# Altium schematic sheet hierarchy.SchDoc
size A3; DocumentNumber: 1; SheetNumber: 1; SheetTotal: 14; SheetDescription: Structure of Extension
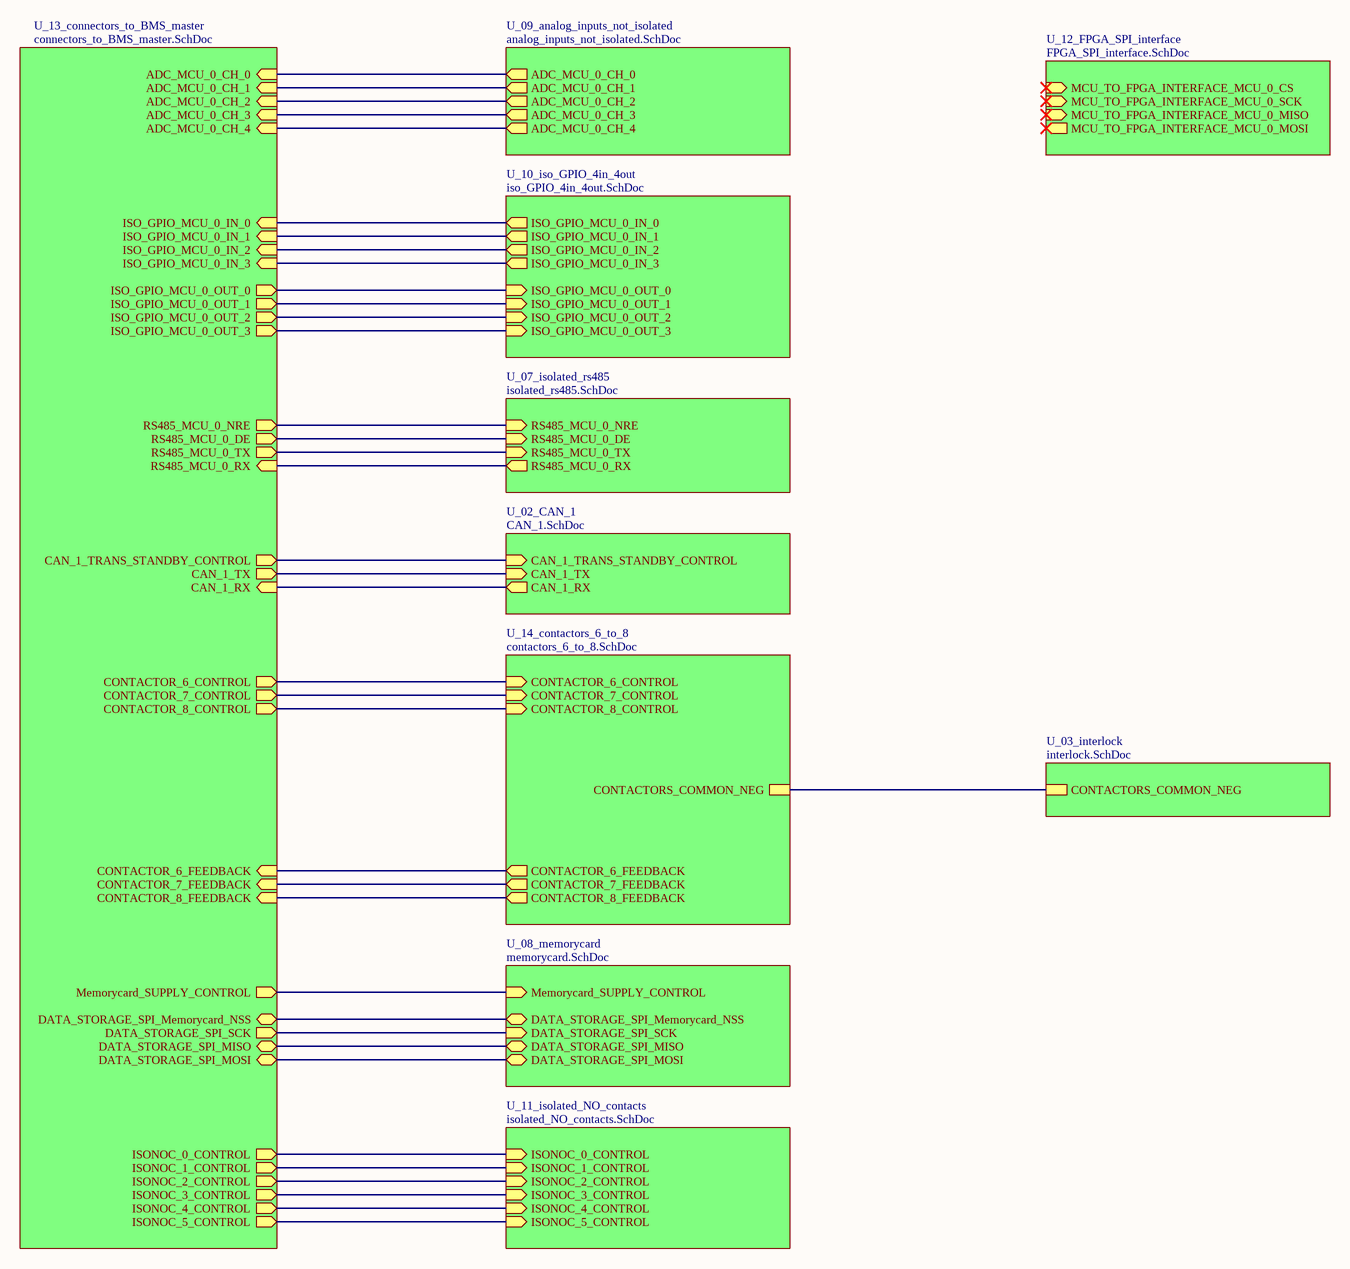
[diagram p0: hierarchy.SchDoc]

## Sub-sheets
U_02_CAN_1 = CAN_1.SchDoc: CAN_1_TX (in), CAN_1_RX (out), CAN_1_TRANS_STANDBY_CONTROL (in)
U_03_interlock = interlock.SchDoc: CONTACTORS_COMMON_NEG
U_07_isolated_rs485 = isolated_rs485.SchDoc: RS485_MCU_0_RX (out), RS485_MCU_0_NRE (in), RS485_MCU_0_DE (in), RS485_MCU_0_TX (in)
U_08_memorycard = memorycard.SchDoc: DATA_STORAGE_SPI_Memorycard_NSS (bidir), Memorycard_SUPPLY_CONTROL (in), DATA_STORAGE_SPI_SCK (in), DATA_STORAGE_SPI_MISO (bidir), DATA_STORAGE_SPI_MOSI (bidir)
U_09_analog_inputs_not_isolated = analog_inputs_not_isolated.SchDoc: ADC_MCU_0_CH_0 (out), ADC_MCU_0_CH_1 (out), ADC_MCU_0_CH_2 (out), ADC_MCU_0_CH_3 (out), ADC_MCU_0_CH_4 (out)
U_10_iso_GPIO_4in_4out = iso_GPIO_4in_4out.SchDoc: ISO_GPIO_MCU_0_OUT_1 (in), ISO_GPIO_MCU_0_IN_0 (out), ISO_GPIO_MCU_0_IN_1 (out), ISO_GPIO_MCU_0_OUT_0 (in), ISO_GPIO_MCU_0_IN_2 (out), ISO_GPIO_MCU_0_IN_3 (out), ISO_GPIO_MCU_0_OUT_2 (in), ISO_GPIO_MCU_0_OUT_3 (in)
U_11_isolated_NO_contacts = isolated_NO_contacts.SchDoc: ISONOC_0_CONTROL (in), ISONOC_1_CONTROL (in), ISONOC_2_CONTROL (in), ISONOC_3_CONTROL (in), ISONOC_4_CONTROL (in), ISONOC_5_CONTROL (in)
U_12_FPGA_SPI_interface = FPGA_SPI_interface.SchDoc: MCU_TO_FPGA_INTERFACE_MCU_0_CS (in), MCU_TO_FPGA_INTERFACE_MCU_0_MOSI (out), MCU_TO_FPGA_INTERFACE_MCU_0_MISO (in), MCU_TO_FPGA_INTERFACE_MCU_0_SCK (in)
U_13_connectors_to_BMS_master = connectors_to_BMS_master.SchDoc: CAN_1_TX (out), CAN_1_RX (in), CAN_1_TRANS_STANDBY_CONTROL (out), ISONOC_5_CONTROL (out), CONTACTOR_6_CONTROL (out), CONTACTOR_7_CONTROL (out), CONTACTOR_8_CONTROL (out), CONTACTOR_6_FEEDBACK (in), CONTACTOR_7_FEEDBACK (in), CONTACTOR_8_FEEDBACK (in), RS485_MCU_0_RX (in), RS485_MCU_0_TX (out), RS485_MCU_0_DE (out), RS485_MCU_0_NRE (out), Memorycard_SUPPLY_CONTROL (out), DATA_STORAGE_SPI_Memorycard_NSS (bidir), DATA_STORAGE_SPI_MISO (bidir), DATA_STORAGE_SPI_MOSI (bidir), DATA_STORAGE_SPI_SCK (out), ADC_MCU_0_CH_0 (in), ADC_MCU_0_CH_1 (in), ADC_MCU_0_CH_2 (in), ADC_MCU_0_CH_3 (in), ADC_MCU_0_CH_4 (in), ISO_GPIO_MCU_0_IN_0 (in), ISO_GPIO_MCU_0_IN_1 (in), ISO_GPIO_MCU_0_IN_2 (in), ISO_GPIO_MCU_0_IN_3 (in), ISO_GPIO_MCU_0_OUT_0 (out), ISO_GPIO_MCU_0_OUT_1 (out), ISO_GPIO_MCU_0_OUT_2 (out), ISO_GPIO_MCU_0_OUT_3 (out), ISONOC_0_CONTROL (out), ISONOC_1_CONTROL (out), ISONOC_2_CONTROL (out), ISONOC_3_CONTROL (out), ISONOC_4_CONTROL (out)
U_14_contactors_6_to_8 = contactors_6_to_8.SchDoc: CONTACTORS_COMMON_NEG, CONTACTOR_7_FEEDBACK (out), CONTACTOR_8_FEEDBACK (out), CONTACTOR_6_FEEDBACK (out), CONTACTOR_7_CONTROL (in), CONTACTOR_6_CONTROL (in), CONTACTOR_8_CONTROL (in)

## Nets
(unnamed): sheet U_02_CAN_1/CAN_1_TX, sheet U_13_connectors_to_BMS_master/CAN_1_TX
(unnamed): sheet U_02_CAN_1/CAN_1_RX, sheet U_13_connectors_to_BMS_master/CAN_1_RX
(unnamed): sheet U_02_CAN_1/CAN_1_TRANS_STANDBY_CONTROL, sheet U_13_connectors_to_BMS_master/CAN_1_TRANS_STANDBY_CONTROL
(unnamed): sheet U_03_interlock/CONTACTORS_COMMON_NEG, sheet U_14_contactors_6_to_8/CONTACTORS_COMMON_NEG
(unnamed): sheet U_07_isolated_rs485/RS485_MCU_0_RX, sheet U_13_connectors_to_BMS_master/RS485_MCU_0_RX
(unnamed): sheet U_07_isolated_rs485/RS485_MCU_0_NRE, sheet U_13_connectors_to_BMS_master/RS485_MCU_0_NRE
(unnamed): sheet U_07_isolated_rs485/RS485_MCU_0_DE, sheet U_13_connectors_to_BMS_master/RS485_MCU_0_DE
(unnamed): sheet U_07_isolated_rs485/RS485_MCU_0_TX, sheet U_13_connectors_to_BMS_master/RS485_MCU_0_TX
(unnamed): sheet U_08_memorycard/DATA_STORAGE_SPI_Memorycard_NSS, sheet U_13_connectors_to_BMS_master/DATA_STORAGE_SPI_Memorycard_NSS
(unnamed): sheet U_08_memorycard/Memorycard_SUPPLY_CONTROL, sheet U_13_connectors_to_BMS_master/Memorycard_SUPPLY_CONTROL
(unnamed): sheet U_08_memorycard/DATA_STORAGE_SPI_SCK, sheet U_13_connectors_to_BMS_master/DATA_STORAGE_SPI_SCK
(unnamed): sheet U_08_memorycard/DATA_STORAGE_SPI_MISO, sheet U_13_connectors_to_BMS_master/DATA_STORAGE_SPI_MISO
(unnamed): sheet U_08_memorycard/DATA_STORAGE_SPI_MOSI, sheet U_13_connectors_to_BMS_master/DATA_STORAGE_SPI_MOSI
(unnamed): sheet U_09_analog_inputs_not_isolated/ADC_MCU_0_CH_0, sheet U_13_connectors_to_BMS_master/ADC_MCU_0_CH_0
(unnamed): sheet U_09_analog_inputs_not_isolated/ADC_MCU_0_CH_1, sheet U_13_connectors_to_BMS_master/ADC_MCU_0_CH_1
(unnamed): sheet U_09_analog_inputs_not_isolated/ADC_MCU_0_CH_2, sheet U_13_connectors_to_BMS_master/ADC_MCU_0_CH_2
(unnamed): sheet U_09_analog_inputs_not_isolated/ADC_MCU_0_CH_3, sheet U_13_connectors_to_BMS_master/ADC_MCU_0_CH_3
(unnamed): sheet U_09_analog_inputs_not_isolated/ADC_MCU_0_CH_4, sheet U_13_connectors_to_BMS_master/ADC_MCU_0_CH_4
(unnamed): sheet U_10_iso_GPIO_4in_4out/ISO_GPIO_MCU_0_OUT_1, sheet U_13_connectors_to_BMS_master/ISO_GPIO_MCU_0_OUT_1
(unnamed): sheet U_10_iso_GPIO_4in_4out/ISO_GPIO_MCU_0_IN_0, sheet U_13_connectors_to_BMS_master/ISO_GPIO_MCU_0_IN_0
(unnamed): sheet U_10_iso_GPIO_4in_4out/ISO_GPIO_MCU_0_IN_1, sheet U_13_connectors_to_BMS_master/ISO_GPIO_MCU_0_IN_1
(unnamed): sheet U_10_iso_GPIO_4in_4out/ISO_GPIO_MCU_0_OUT_0, sheet U_13_connectors_to_BMS_master/ISO_GPIO_MCU_0_OUT_0
(unnamed): sheet U_10_iso_GPIO_4in_4out/ISO_GPIO_MCU_0_IN_2, sheet U_13_connectors_to_BMS_master/ISO_GPIO_MCU_0_IN_2
(unnamed): sheet U_10_iso_GPIO_4in_4out/ISO_GPIO_MCU_0_IN_3, sheet U_13_connectors_to_BMS_master/ISO_GPIO_MCU_0_IN_3
(unnamed): sheet U_10_iso_GPIO_4in_4out/ISO_GPIO_MCU_0_OUT_2, sheet U_13_connectors_to_BMS_master/ISO_GPIO_MCU_0_OUT_2
(unnamed): sheet U_10_iso_GPIO_4in_4out/ISO_GPIO_MCU_0_OUT_3, sheet U_13_connectors_to_BMS_master/ISO_GPIO_MCU_0_OUT_3
(unnamed): sheet U_11_isolated_NO_contacts/ISONOC_0_CONTROL, sheet U_13_connectors_to_BMS_master/ISONOC_0_CONTROL
(unnamed): sheet U_11_isolated_NO_contacts/ISONOC_1_CONTROL, sheet U_13_connectors_to_BMS_master/ISONOC_1_CONTROL
(unnamed): sheet U_11_isolated_NO_contacts/ISONOC_2_CONTROL, sheet U_13_connectors_to_BMS_master/ISONOC_2_CONTROL
(unnamed): sheet U_11_isolated_NO_contacts/ISONOC_3_CONTROL, sheet U_13_connectors_to_BMS_master/ISONOC_3_CONTROL
(unnamed): sheet U_11_isolated_NO_contacts/ISONOC_4_CONTROL, sheet U_13_connectors_to_BMS_master/ISONOC_4_CONTROL
(unnamed): sheet U_11_isolated_NO_contacts/ISONOC_5_CONTROL, sheet U_13_connectors_to_BMS_master/ISONOC_5_CONTROL
(unnamed): sheet U_13_connectors_to_BMS_master/CONTACTOR_6_CONTROL, sheet U_14_contactors_6_to_8/CONTACTOR_6_CONTROL
(unnamed): sheet U_13_connectors_to_BMS_master/CONTACTOR_7_CONTROL, sheet U_14_contactors_6_to_8/CONTACTOR_7_CONTROL
(unnamed): sheet U_13_connectors_to_BMS_master/CONTACTOR_8_CONTROL, sheet U_14_contactors_6_to_8/CONTACTOR_8_CONTROL
(unnamed): sheet U_13_connectors_to_BMS_master/CONTACTOR_6_FEEDBACK, sheet U_14_contactors_6_to_8/CONTACTOR_6_FEEDBACK
(unnamed): sheet U_13_connectors_to_BMS_master/CONTACTOR_7_FEEDBACK, sheet U_14_contactors_6_to_8/CONTACTOR_7_FEEDBACK
(unnamed): sheet U_13_connectors_to_BMS_master/CONTACTOR_8_FEEDBACK, sheet U_14_contactors_6_to_8/CONTACTOR_8_FEEDBACK

## Notes on the sheet
- Fraunhofer IISB
- Schottkystr. 10
- developed by:
- 91058 Erlangen
- Germany
- Author
- Project
- License
- Description
- File
- Version
- Release Date
- Sheet
- www.foxbms.org
- www.iisb.fraunhofer.de
- foxBMS Team
- /